# EAGLE schematic deska_vyrobena (EAGLE 9.5.0)
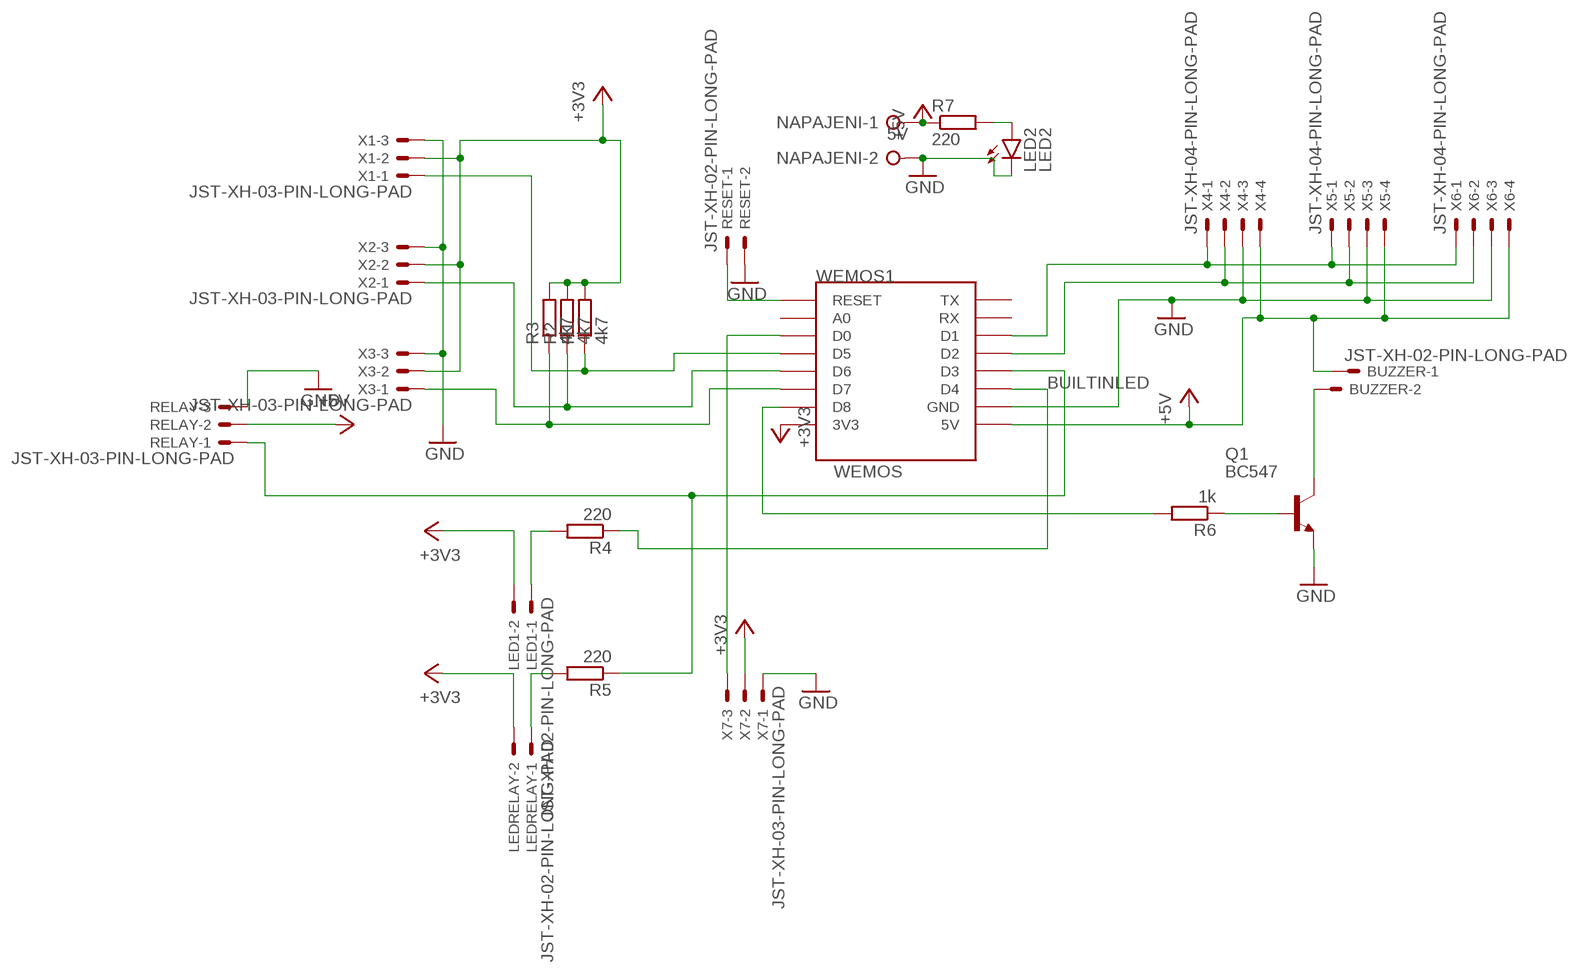
[diagram p0: schematic, sheet 1]

## Parts
BUZZER  JST-XH-02-PIN-LONG-PAD  [JST-XH-02-PACKAGE-LONG-PAD]
LED1  JST-XH-02-PIN-LONG-PAD  [JST-XH-02-PACKAGE-LONG-PAD]
LED2  LED2  LED3MM  [LED3MM]
LEDRELAY  JST-XH-02-PIN-LONG-PAD  [JST-XH-02-PACKAGE-LONG-PAD]
NAPAJENI  5V  W237-02P  [W237-132]
Q1  BC547  [TO92]
R1  4k7  R-EU_0207/7  [0207/7]
R2  4k7  R-EU_0207/7  [0207/7]
R3  4k7  R-EU_0207/7  [0207/7]
R4  220  R-EU_0207/7  [0207/7]
R5  220  R-EU_0207/7  [0207/7]
R6  1k  R-EU_0207/7  [0207/7]
R7  220  R-EU_0207/7  [0207/7]
RELAY  JST-XH-03-PIN-LONG-PAD  [JST-XH-03-PACKAGE-LONG-PAD]
RESET  JST-XH-02-PIN-LONG-PAD  [JST-XH-02-PACKAGE-LONG-PAD]
WEMOS1  WEMOS  WEMOS-D1-MINI  [WEMOS-D1-MINI]
X1  JST-XH-03-PIN-LONG-PAD  [JST-XH-03-PACKAGE-LONG-PAD]
X2  JST-XH-03-PIN-LONG-PAD  [JST-XH-03-PACKAGE-LONG-PAD]
X3  JST-XH-03-PIN-LONG-PAD  [JST-XH-03-PACKAGE-LONG-PAD]
X4  JST-XH-04-PIN-LONG-PAD  [JST-XH-04-PACKAGE-LONG-PAD]
X5  JST-XH-04-PIN-LONG-PAD  [JST-XH-04-PACKAGE-LONG-PAD]
X6  JST-XH-04-PIN-LONG-PAD  [JST-XH-04-PACKAGE-LONG-PAD]
X7  JST-XH-03-PIN-LONG-PAD  [JST-XH-03-PACKAGE-LONG-PAD]

## Nets
+3V3: LED1.2 LEDRELAY.2 R1.2 R2.2 R3.2 WEMOS1.3V3 X1.2 X2.2 X3.2 X7.2
+5V: BUZZER.1 NAPAJENI.1 R7.1 RELAY.2 WEMOS1.5V X4.4 X5.4 X6.4
BUILTINLED: R4.1 WEMOS1.D4
GND: LED2.K(C) NAPAJENI.2 Q1.1(E) RELAY.3 RESET.2 WEMOS1.GND X1.3 X2.3 X3.3 X4.3 X5.3 X6.3 X7.1
N$1: R1.1 WEMOS1.D5 X1.1
N$2: LEDRELAY.1 R5.2
N$4: LED2.A R7.2
N$5: RESET.1 WEMOS1.RESET
N$6: LED1.1 R4.2
N$7: Q1.2(B) R6.1
N$8: R6.2 WEMOS1.D8
N$9: R3.1 WEMOS1.D7 X3.1
N$10: WEMOS1.D0 X7.3
N$11: WEMOS1.D1 X4.1 X5.1 X6.1
N$12: WEMOS1.D2 X4.2 X5.2 X6.2
N$14: R5.1 RELAY.1 WEMOS1.D3
N$15: BUZZER.2 Q1.3(C)
N$19: R2.1 WEMOS1.D6 X2.1
Unconnected: WEMOS1.A0 WEMOS1.RX WEMOS1.TX

## Library data of the parts
BUZZER LED1 LEDRELAY RESET = Rembrandt Electronics - JST XH Connectors v1-0:JST-XH-02-PIN: JST XH Connector 2 Pin Wire to board connector. Pitch: 2,54 mm, (0.100") Number of pins: 2 Created by Rembrandt Electronics www.rembrandtelectronics.com
LED2 = led:LED: LED OSRAM: - CHIPLED LG R971, LG N971, LY N971, LG Q971, LY Q971, LO R971, LY R971 LH N974, LH R974 LS Q976, LO Q976, LY Q976 LO Q996 - Hyper CHIPLED LW Q18S LB Q993, LB Q99A, LB R99A - SideLED LS A670, LO A670, LY A670, LG A670, LP A670 LB A673, LV A673, LT A673, LW A673 LH A674 LY A675 LS A676, LA A676, LO A676, LY A676, LW A676 LS A679, LY A679, LG A679 - Hyper Micro SIDELED® LS Y876, LA Y876, LO Y876, LY Y876 LT Y87S - SmartLED LW L88C, LW L88S LB L89C, LB L89S, LG L890 LS L89K, LO L89K, LY L89K LS L896, LA L896, LO L896, LY L896 - TOPLED LS T670, LO T670, LY T670, LG T670, LP T670 LSG T670, LSP T670, LSY T670, LOP T670, LYG T670 LG T671, LOG T671, LSG T671 LB T673, LV T673, LT T673, LW T673 LH T674 LS T676, LA T676, LO T676, LY T676, LB T676, LH T676, LSB T676, LW T676 LB T67C, LV T67C, LT T67C, LS T67K, LO T67K, LY T67K, LW E67C LS E67B, LA E67B, LO E67B, LY E67B, LB E67C, LV E67C, LT E67C LW T67C LS T679, LY T679, LG T679 LS T770, LO T770, LY T770, LG T770, LP T770 LB T773, LV T773, LT T773, LW T773 LH T774 LS E675, LA E675, LY E675, LS T675 LS T776, LA T776, LO T776, LY T776, LB T776 LHGB T686 LT T68C, LB T68C - Hyper Mini TOPLED® LB M676 - Mini TOPLED Santana® LG M470 LS M47K, LO M47K, LY M47K Source: http://www.osram.convergy.de LUXEON: - LUMILED® LXK2-PW12-R00, LXK2-PW12-S00, LXK2-PW14-U00, LXK2-PW14-V00 LXK2-PM12-R00, LXK2-PM12-S00, LXK2-PM14-U00 LXK2-PE12-Q00, LXK2-PE12-R00, LXK2-PE12-S00, LXK2-PE14-T00, LXK2-PE14-U00 LXK2-PB12-K00, LXK2-PB12-L00, LXK2-PB12-M00, LXK2-PB14-N00, LXK2-PB14-P00, LXK2-PB14-Q00 LXK2-PR12-L00, LXK2-PR12-M00, LXK2-PR14-Q00, LXK2-PR14-R00 LXK2-PD12-Q00, LXK2-PD12-R00, LXK2-PD12-S00 LXK2-PH12-R00, LXK2-PH12-S00 LXK2-PL12-P00, LXK2-PL12-Q00, LXK2-PL12-R00 Source: www.luxeon.com KINGBRIGHT: KA-3528ASYC Source: www.kingbright.com
NAPAJENI = con-wago-508:W237-02P: WAGO SREW CLAMP; OC_FARNELL: unknown; OC_NEWARK: unknown
Q1 = transistor-npn:BC547*: NPN Transistor
R1-R7 = rcl:R-EU_: RESISTOR, European symbol
RELAY X1-X3 X7 = Rembrandt Electronics - JST XH Connectors v1-0:JST-XH-03-PIN: JST XH Connector 2 Pin Wire to board connector. Pitch: 2,54 mm, (0.100") Number of pins: 3 Created by Rembrandt Electronics www.rembrandtelectronics.com
WEMOS1 = wemos:WEMOS-D1-MINI: WeMos.cc D1 mini ESP8266 module
X4-X6 = Rembrandt Electronics - JST XH Connectors v1-0:JST-XH-04-PIN: JST XH Connector 2 Pin Wire to board connector. Pitch: 2,54 mm, (0.100") Number of pins: 4 Created by Rembrandt Electronics www.rembrandtelectronics.com